# Altium project FRB_Simconex.PrjPcb
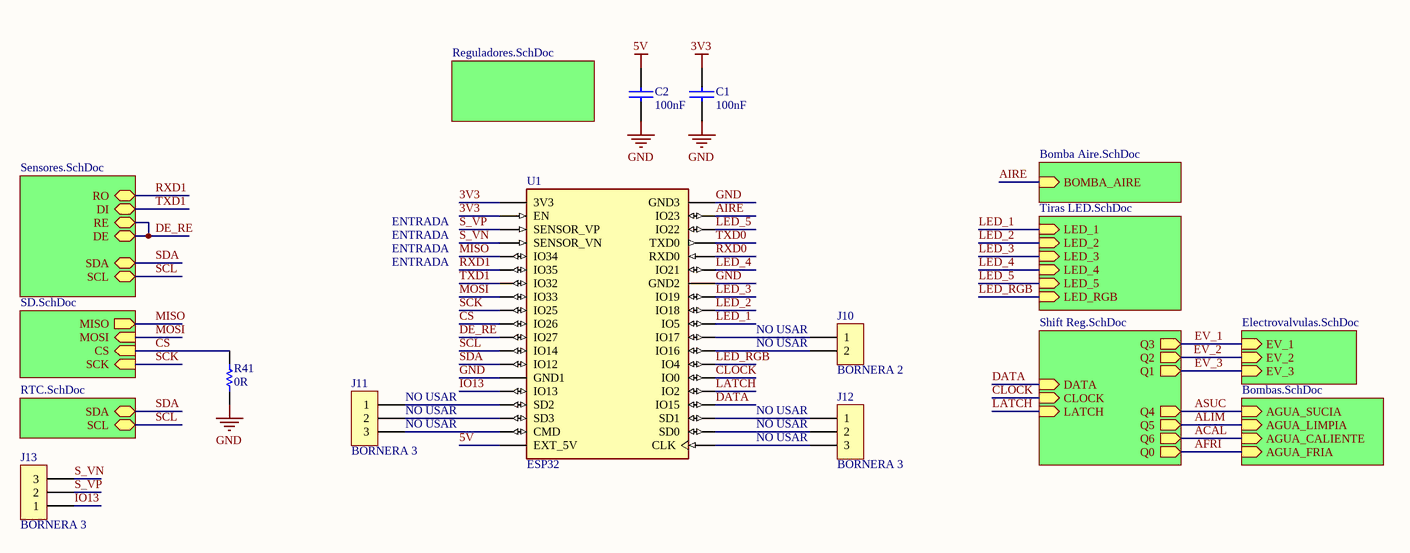
[diagram p0: FRB_Simconex.SchDoc]
8 sheets, 62 parts. Net scope: hierarchical (ports join the sheet entries above them; power ports are global).
Board file: FRB_Simconex.PcbDoc
Sheets:
  FRB_Simconex.SchDoc
    Designator = Sensores.SchDoc
    Designator = Reguladores.SchDoc
    Designator = Bombas.SchDoc
    Designator = SD.SchDoc
    Designator = RTC.SchDoc
    Designator = Shift Reg.SchDoc
  TTL USB.SchDoc

## Sheet FRB_Simconex.SchDoc
size A4

### Parts
C1  100nF  [0805]
C2  100nF  [0805]
J10  BORNERA 2  [BORNERA2]
J11  BORNERA 3  [BORNERA3]
J12  BORNERA 3  [BORNERA3]
J13  BORNERA 3  [BORNERA3]
R41  0R  [0805]
U1  ESP32  [ESP32]

### Sub-sheets
Designator = Tiras LED.SchDoc (file not in this document): LED_3 (in), LED_2 (in), LED_5 (in), LED_1 (in), LED_4 (in), LED_RGB (in)
Designator = Sensores.SchDoc: SDA (bidir), SCL (bidir), DI (bidir), RO (bidir), DE (bidir), RE (bidir)
Designator = Reguladores.SchDoc: no entries
Designator = Electrovalvulas.SchDoc (file not in this document): EV_1 (in), EV_2 (in), EV_3 (in)
Designator = Bombas.SchDoc: AGUA_SUCIA (in), AGUA_LIMPIA (in), AGUA_CALIENTE (in), AGUA_FRIA (in)
Designator = Bomba Aire.SchDoc (file not in this document): BOMBA_AIRE (in)
Designator = SD.SchDoc: CS (in), MOSI (in), SCK (in), MISO (out)
Designator = RTC.SchDoc: SDA (bidir), SCL (bidir)
Designator = Shift Reg.SchDoc: CLOCK (in), LATCH (in), DATA (in), Q3 (out), Q0 (out), Q5 (out), Q2 (out), Q4 (out), Q1 (out), Q6 (out)

### Nets
3V3: C1.1 U1.J2-1(3V3) U1.J2-2(EN)
5V: C2.1 U1.J2-19(EXT_5V)
GND: C1.2 C2.2 R41.1 U1.J2-14(GND1) U1.J3-1(GND3) U1.J3-7(GND2)
ACAL: sheet Designator/AGUA_CALIENTE, sheet Designator/Q6
AFRI: sheet Designator/AGUA_FRIA, sheet Designator/Q0
AIRE: U1.J3-2(IO23) ; sheet Designator/BOMBA_AIRE
ALIM: sheet Designator/AGUA_LIMPIA, sheet Designator/Q5
ASUC: sheet Designator/AGUA_SUCIA, sheet Designator/Q4
CLOCK: U1.J3-14(IO0) ; sheet Designator/CLOCK
CS: R41.2 U1.J2-10(IO26) ; sheet Designator/CS
DATA: U1.J3-16(IO15) ; sheet Designator/DATA
DE_RE: U1.J2-11(IO27) ; sheet Designator/DE, sheet Designator/RE
EV_1: sheet Designator/EV_1, sheet Designator/Q3
EV_2: sheet Designator/EV_2, sheet Designator/Q2
EV_3: sheet Designator/EV_3, sheet Designator/Q1
IO13: J13.1 U1.J2-15(IO13)
LATCH: U1.J3-15(IO2) ; sheet Designator/LATCH
LED_1: U1.J3-10(IO5) ; sheet Designator/LED_1
LED_2: U1.J3-9(IO18) ; sheet Designator/LED_2
LED_3: U1.J3-8(IO19) ; sheet Designator/LED_3
LED_4: U1.J3-6(IO21) ; sheet Designator/LED_4
LED_5: U1.J3-3(IO22) ; sheet Designator/LED_5
LED_RGB: U1.J3-13(IO4) ; sheet Designator/LED_RGB
MISO: U1.J2-5(IO34) ; sheet Designator/MISO
MOSI: U1.J2-8(IO33) ; sheet Designator/MOSI
RXD0: U1.J3-5(RXD0)
RXD1: U1.J2-6(IO35) ; sheet Designator/RO
S_VN: J13.3 U1.J2-4(SENSOR_VN)
S_VP: J13.2 U1.J2-3(SENSOR_VP)
SCK: U1.J2-9(IO25) ; sheet Designator/SCK
SCL: U1.J2-12(IO14) ; sheet Designator/SCL, sheet Designator/SCL
SDA: U1.J2-13(IO12) ; sheet Designator/SDA, sheet Designator/SDA
TXD0: U1.J3-4(TXD0)
TXD1: U1.J2-7(IO32) ; sheet Designator/DI
NetJ10_1: J10.1 U1.J3-11(IO17)
NetJ10_2: J10.2 U1.J3-12(IO16)
NetJ11_1: J11.1 U1.J2-16(SD2)
NetJ11_2: J11.2 U1.J2-17(SD3)
NetJ11_3: J11.3 U1.J2-18(CMD)
NetJ12_1: J12.1 U1.J3-17(SD1)
NetJ12_2: J12.2 U1.J3-18(SD0)
NetJ12_3: J12.3 U1.J3-19(CLK)

### Notes on the sheet
- ENTRADA
- (near J10) NO USAR
- (near J11) NO USAR
- (near J12) NO USAR

### Library data of the parts
C1 C2 = CAP
R41 = RES

## Sheet Sensores.SchDoc
size A4
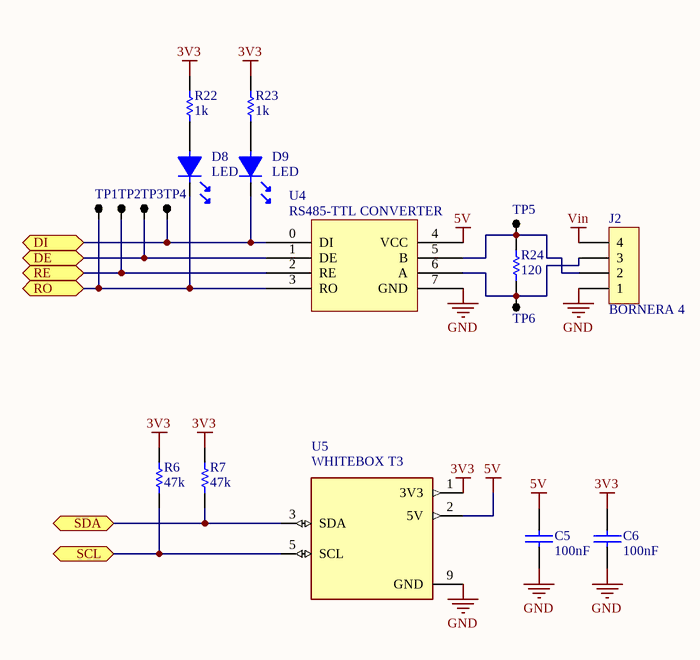
[diagram p1: Sensores.SchDoc]

### Parts
C5  100nF  [0805]
C6  100nF  [0805]
D8  LED  [LED0805]
D9  LED  [LED0805]
J2  BORNERA 4  [BORNERA4]
R6  47k  [0805]
R7  47k  [0805]
R22  1k  [0805]
R23  1k  [0805]
R24  120  [0805]
TP1  TP  [TPSMD]  (value not drawn)
TP2  TP  [TPSMD]  (value not drawn)
TP3  TP  [TPSMD]  (value not drawn)
TP4  TP  [TPSMD]  (value not drawn)
TP5  TP  [TPSMD]  (value not drawn)
TP6  TP  [TPSMD]  (value not drawn)
U4  RS485-TTL CONVERTER  [TTL-RS485 CONVERTER]
U5  WHITEBOX T3  [Whitebox T3 for Raspberry Pi]

### Ports
DE (bidir), DI (bidir), RE (bidir), RO (bidir), SCL (bidir), SDA (bidir)

### Nets
3V3: C6.1 R6.2 R7.2 R22.2 R23.2 U5.1(3V3)
5V: C5.1 U4.4(VCC) U5.2(5V)
GND: C5.2 C6.2 J2.1 U4.7(GND) U5.9(GND)
Vin: J2.4
DE_RE: TP2.1 TP3.1 U4.1(DE) U4.2(RE) ; port DE, port RE
RXD1: D8.2 TP1.1 U4.3(RO) ; port RO
SCL: R6.1 U5.5(SCL) ; port SCL
SDA: R7.1 U5.3(SDA) ; port SDA
TXD1: D9.2 TP4.1 U4.0(DI) ; port DI
NetD8_1: D8.1 R22.1
NetD9_1: D9.1 R23.1
NetJ2_2: J2.2 R24.2 TP5.1 U4.5(B)
NetJ2_3: J2.3 R24.1 TP6.1 U4.6(A)

### Library data of the parts
C5 C6 = CAP
R6 R7 R22-R24 = RES
U5 = WHITEBOX T3 FOR RASPBERRY PI

## Sheet Reguladores.SchDoc
size A4
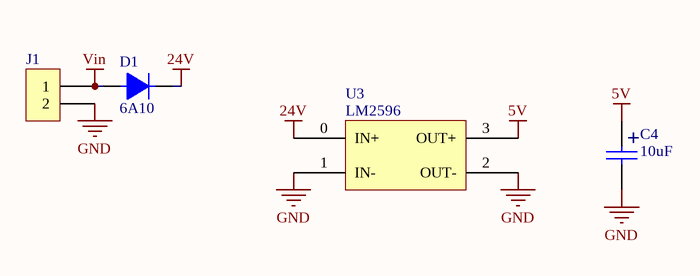
[diagram p2: Reguladores.SchDoc]

### Parts
C4  10uF  [CAP.ELEC]
D1  6A10  [DO214AC]
J1  BORNERA 2  [BORNERA2]  (value not drawn)
U3  LM2596  [LM2596 DC TO DC CONVERTER MODULE]

### Nets
5V: C4.1 U3.3(OUT+)
24V: D1.2 U3.0(IN+)
GND: C4.2 J1.2 U3.1(IN-) U3.2(OUT-)
Vin: D1.1 J1.1

### Notes on the sheet
- (in symbol CAPPOL) +

### Library data of the parts
C4 = CAPPOL
D1 = DIODO

## Sheet Bombas.SchDoc
size A4
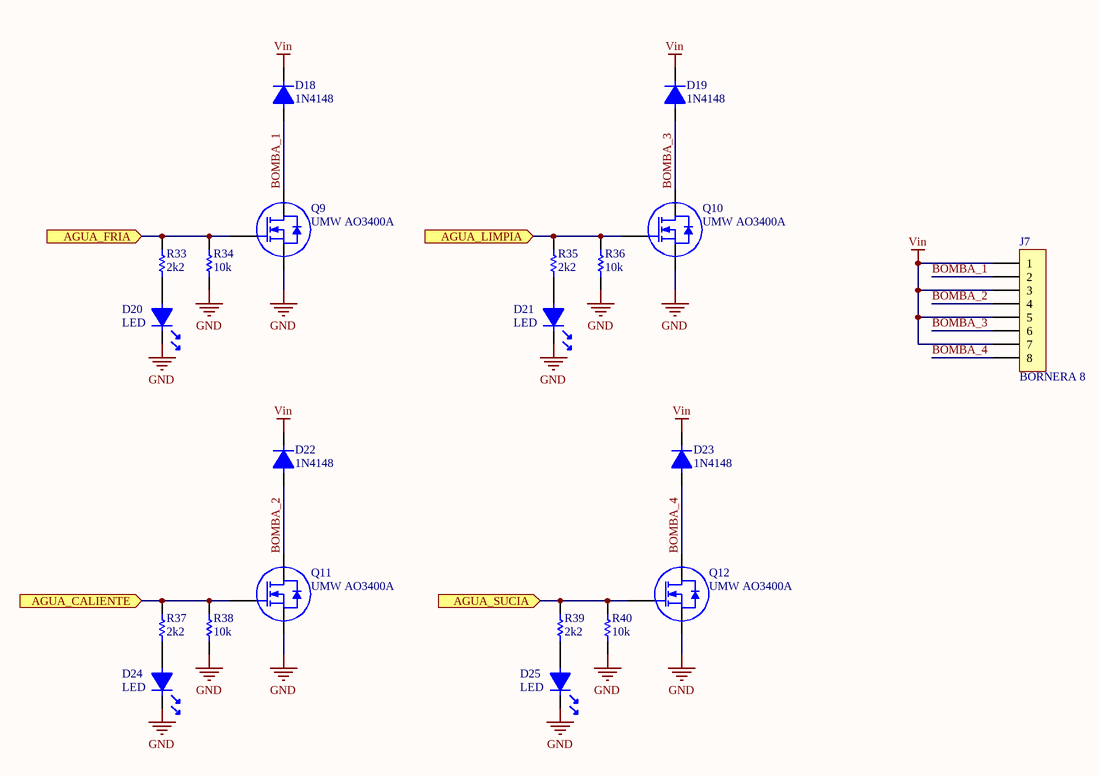
[diagram p3: Bombas.SchDoc]

### Parts
D18  1N4148  [1206K]
D19  1N4148  [1206K]
D20  LED  [LED0805]
D21  LED  [LED0805]
D22  1N4148  [1206K]
D23  1N4148  [1206K]
D24  LED  [LED0805]
D25  LED  [LED0805]
J7  BORNERA 8  [BORNERA8]
Q9  UMW AO3400A  [SOT23]
Q10  UMW AO3400A  [SOT23]
Q11  UMW AO3400A  [SOT23]
Q12  UMW AO3400A  [SOT23]
R33  2k2  [0805]
R34  10k  [0805]
R35  2k2  [0805]
R36  10k  [0805]
R37  2k2  [0805]
R38  10k  [0805]
R39  2k2  [0805]
R40  10k  [0805]

### Ports
AGUA_CALIENTE (in), AGUA_FRIA (in), AGUA_LIMPIA (in), AGUA_SUCIA (in)

### Nets
GND: D20.2 D21.2 D24.2 D25.2 Q9.3(S) Q10.3(S) Q11.3(S) Q12.3(S) R34.1 R36.1 R38.1 R40.1
Vin: D18.2 D19.2 D22.2 D23.2 J7.1 J7.3 J7.5 J7.7
ACAL: Q11.1(G) R37.2 R38.2 ; port AGUA_CALIENTE
AFRI: Q9.1(G) R33.2 R34.2 ; port AGUA_FRIA
ALIM: Q10.1(G) R35.2 R36.2 ; port AGUA_LIMPIA
ASUC: Q12.1(G) R39.2 R40.2 ; port AGUA_SUCIA
BOMBA_1: D18.1 J7.2 Q9.2(D)
BOMBA_2: D22.1 J7.4 Q11.2(D)
BOMBA_3: D19.1 J7.6 Q10.2(D)
BOMBA_4: D23.1 J7.8 Q12.2(D)
NetD20_1: D20.1 R33.1
NetD21_1: D21.1 R35.1
NetD24_1: D24.1 R37.1
NetD25_1: D25.1 R39.1

### Library data of the parts
D18 D19 D22 D23 = DIODO
Q9-Q12 = MOSFET N
R33-R40 = RES

## Sheet SD.SchDoc
size A4
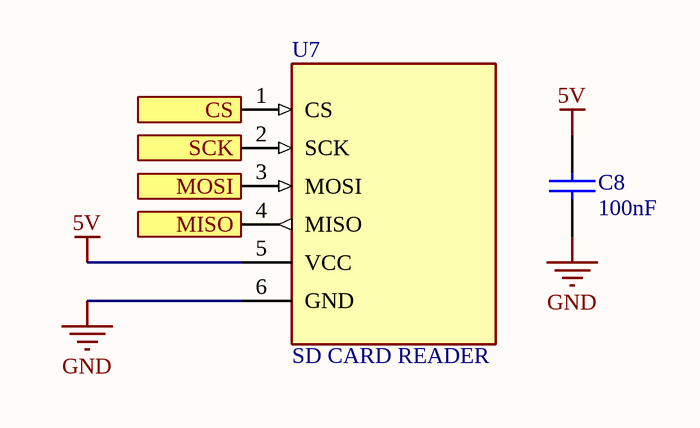
[diagram p4: SD.SchDoc]

### Parts
C8  100nF  [0805]
U7  SD CARD READER  [SD CARD]

### Ports
CS (in), MISO (out), MOSI (in), SCK (in)

### Nets
5V: C8.1 U7.5(VCC)
GND: C8.2 U7.6(GND)
CS: U7.1(CS) ; port CS
MISO: U7.4(MISO) ; port MISO
MOSI: U7.3(MOSI) ; port MOSI
SCK: U7.2(SCK) ; port SCK

### Library data of the parts
C8 = CAP
U7 = SD_CARD

## Sheet RTC.SchDoc
size A4
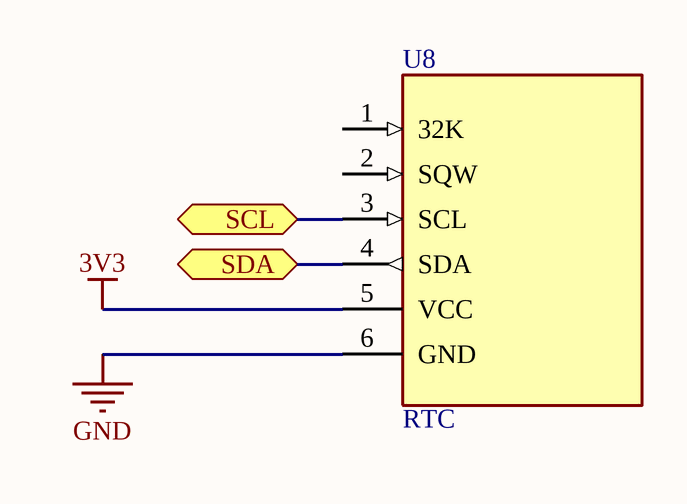
[diagram p5: RTC.SchDoc]

### Parts
U8  RTC  [DS3231]

### Ports
SCL (bidir), SDA (bidir)

### Nets
3V3: U8.5(VCC)
GND: U8.6(GND)
SCL: U8.3(SCL) ; port SCL
SDA: U8.4(SDA) ; port SDA

Not connected (* = marked no-connect by the designer): U8 1(32K) 2(SQW)

### Library data of the parts
U8 = DS3231

## Sheet Shift Reg.SchDoc
size A4
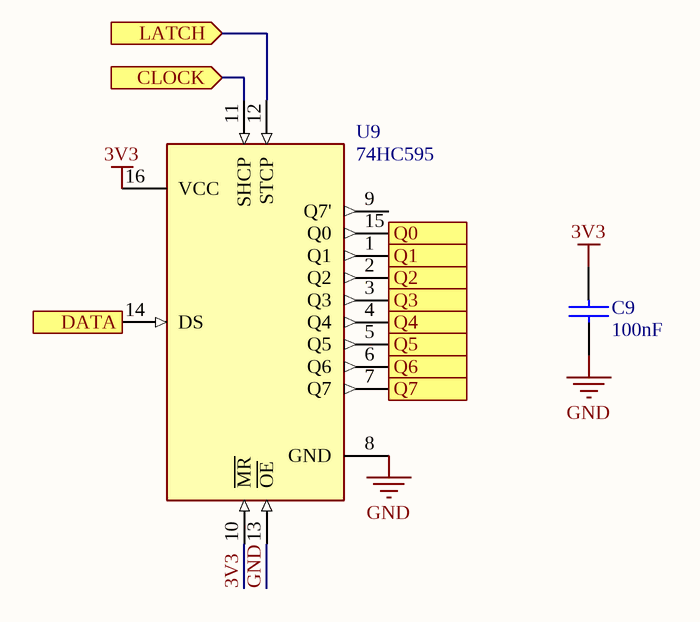
[diagram p6: Shift Reg.SchDoc]

### Parts
C9  100nF  [0805]
U9  74HC595  [SOIC16N]

### Ports
CLOCK (in), DATA (in), LATCH (in), Q0 (out), Q1 (out), Q2 (out), Q3 (out), Q4 (out), Q5 (out), Q6 (out), Q7 (out)

### Nets
3V3: C9.1 U9.10(~{MR}) U9.16(VCC)
GND: C9.2 U9.8(GND) U9.13(~{OE})
ACAL: U9.6(Q6) ; port Q6
AFRI: U9.15(Q0) ; port Q0
ALIM: U9.5(Q5) ; port Q5
ASUC: U9.4(Q4) ; port Q4
CLOCK: U9.11(SHCP) ; port CLOCK
DATA: U9.14(DS) ; port DATA
EV_1: U9.3(Q3) ; port Q3
EV_2: U9.2(Q2) ; port Q2
EV_3: U9.1(Q1) ; port Q1
LATCH: U9.12(STCP) ; port LATCH
NetU9_7: U9.7(Q7) ; port Q7

Not connected (* = marked no-connect by the designer): U9 9(Q7')

### Library data of the parts
C9 = CAP

## Sheet TTL USB.SchDoc
size A4
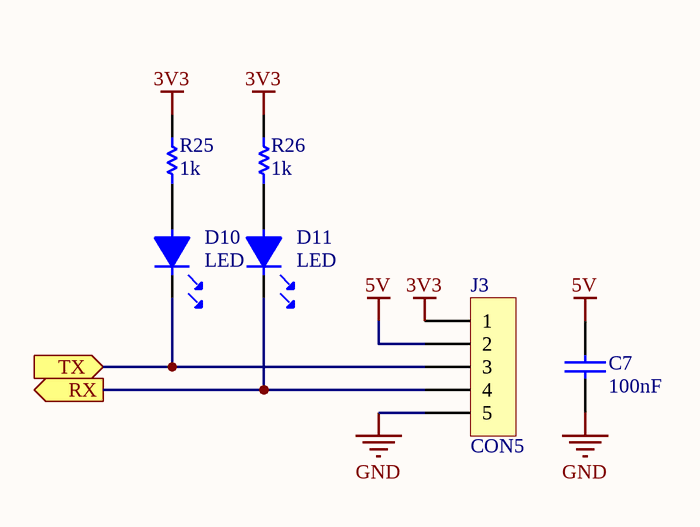
[diagram p7: TTL USB.SchDoc]

### Parts
C7  100nF  [0805]
D10  LED  [LED0805]
D11  LED  [LED0805]
J3  CON5  [SIP5]
R25  1k  [0805]
R26  1k  [0805]

### Ports
RX (out), TX (in)

### Nets
3V3: J3.1 R25.2 R26.2
5V: C7.1 J3.2
GND: C7.2 J3.5
NetD10_1: D10.1 R25.1
NetD10_2: D10.2 J3.3 ; port TX
NetD11_1: D11.1 R26.1
NetD11_2: D11.2 J3.4 ; port RX

### Library data of the parts
C7 = CAP
R25 R26 = RES

## Nets that join several sheets
3V3: FRB_Simconex (C1.1 U1.J2-1 U1.J2-2), Sensores (6 pins), RTC (U8.5), Shift Reg (C9.1 U9.10 U9.16), TTL USB (J3.1 R25.2 R26.2)
5V: FRB_Simconex (C2.1 U1.J2-19), Sensores (C5.1 U4.4 U5.2), Reguladores (C4.1 U3.3), SD (C8.1 U7.5), TTL USB (C7.1 J3.2)
GND: FRB_Simconex (6 pins), Sensores (5 pins), Reguladores (C4.2 J1.2 U3.1 U3.2), Bombas (12 pins), SD (C8.2 U7.6), RTC (U8.6), Shift Reg (C9.2 U9.8 U9.13), TTL USB (C7.2 J3.5)
Vin: Sensores (J2.4), Reguladores (D1.1 J1.1), Bombas (8 pins)
ACAL: Bombas (Q11.1 R37.2 R38.2), Shift Reg (U9.6)
AFRI: Bombas (Q9.1 R33.2 R34.2), Shift Reg (U9.15)
ALIM: Bombas (Q10.1 R35.2 R36.2), Shift Reg (U9.5)
ASUC: Bombas (Q12.1 R39.2 R40.2), Shift Reg (U9.4)
CLOCK: FRB_Simconex (U1.J3-14), Shift Reg (U9.11)
CS: FRB_Simconex (R41.2 U1.J2-10), SD (U7.1)
DATA: FRB_Simconex (U1.J3-16), Shift Reg (U9.14)
DE_RE: FRB_Simconex (U1.J2-11), Sensores (TP2.1 TP3.1 U4.1 U4.2)
LATCH: FRB_Simconex (U1.J3-15), Shift Reg (U9.12)
MISO: FRB_Simconex (U1.J2-5), SD (U7.4)
MOSI: FRB_Simconex (U1.J2-8), SD (U7.3)
RXD1: FRB_Simconex (U1.J2-6), Sensores (D8.2 TP1.1 U4.3)
SCK: FRB_Simconex (U1.J2-9), SD (U7.2)
SCL: FRB_Simconex (U1.J2-12), Sensores (R6.1 U5.5), RTC (U8.3)
SDA: FRB_Simconex (U1.J2-13), Sensores (R7.1 U5.3), RTC (U8.4)
TXD1: FRB_Simconex (U1.J2-7), Sensores (D9.2 TP4.1 U4.0)